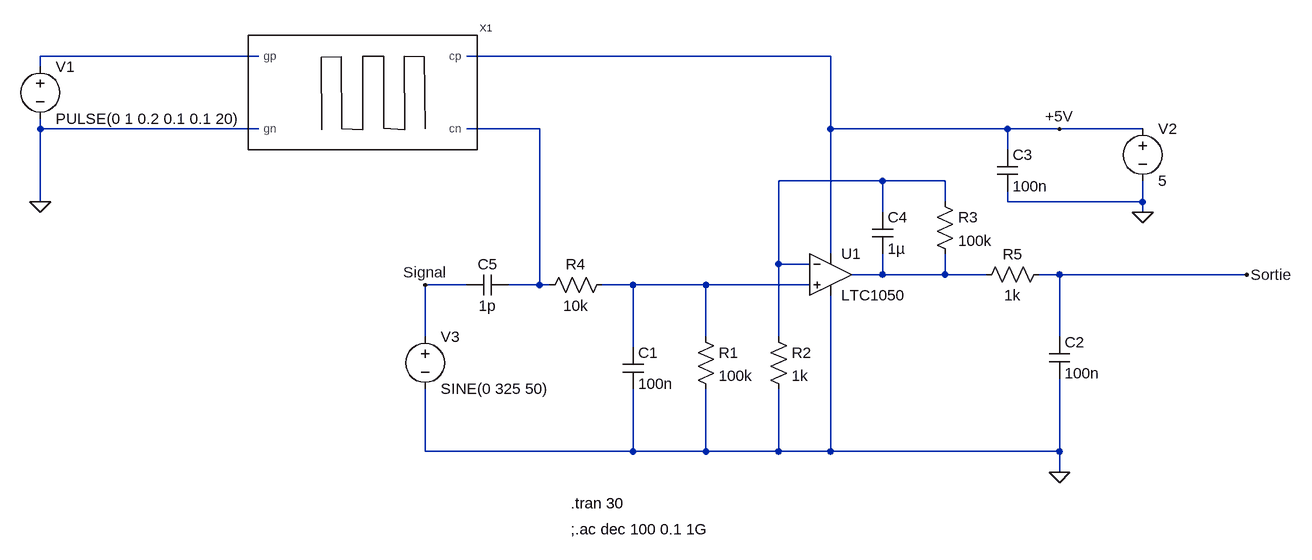
[diagram p0: schematic Draft1.asc]
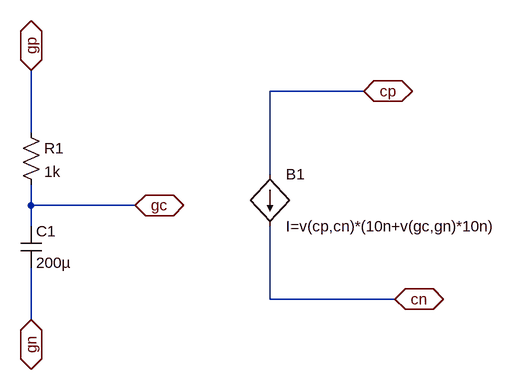
[diagram p1: sub-circuit capteur.asc]
Draft1.asc, the LTspice schematic file:
Version 4
SHEET 1 880 680
WIRE -992 -160 -1328 -160
WIRE -112 -160 -672 -160
WIRE -1328 -144 -1328 -160
WIRE -1328 -48 -1328 -64
WIRE -992 -48 -1328 -48
WIRE -560 -48 -672 -48
WIRE -112 -48 -112 -160
WIRE 160 -48 -112 -48
WIRE 240 -48 160 -48
WIRE 368 -48 240 -48
WIRE 160 -16 160 -48
WIRE -32 32 -192 32
WIRE 64 32 -32 32
WIRE -1328 64 -1328 -48
WIRE 64 64 64 32
WIRE 160 64 160 48
WIRE 368 64 368 32
WIRE 368 64 160 64
WIRE -32 80 -32 32
WIRE 368 80 368 64
WIRE -112 144 -112 -48
WIRE -192 160 -192 32
WIRE -144 160 -192 160
WIRE -32 176 -32 144
WIRE -32 176 -80 176
WIRE 64 176 64 144
WIRE 64 176 -32 176
WIRE 128 176 64 176
WIRE 240 176 208 176
WIRE 528 176 240 176
WIRE -672 192 -736 192
WIRE -560 192 -560 -48
WIRE -560 192 -608 192
WIRE -544 192 -560 192
WIRE -416 192 -464 192
WIRE -304 192 -416 192
WIRE -144 192 -304 192
WIRE -736 272 -736 192
WIRE -304 272 -304 192
WIRE -192 272 -192 160
WIRE 240 272 240 176
WIRE -416 288 -416 192
WIRE -736 448 -736 352
WIRE -416 448 -416 352
WIRE -416 448 -736 448
WIRE -304 448 -304 352
WIRE -304 448 -416 448
WIRE -192 448 -192 352
WIRE -192 448 -304 448
WIRE -112 448 -112 208
WIRE -112 448 -192 448
WIRE 240 448 240 336
WIRE 240 448 -112 448
WIRE 240 480 240 448
FLAG 240 480 0
FLAG 368 80 0
FLAG 240 -48 +5V
FLAG -736 192 Signal
FLAG 528 176 Sortie
FLAG -1328 64 0
SYMBOL res -320 256 R0
SYMATTR InstName R1
SYMATTR Value 100k
SYMBOL res -208 256 R0
SYMATTR InstName R2
SYMATTR Value 1k
SYMBOL res 48 48 R0
SYMATTR InstName R3
SYMATTR Value 100k
SYMBOL res -448 176 R90
WINDOW 0 0 56 VBottom 2
WINDOW 3 32 56 VTop 2
SYMATTR InstName R4
SYMATTR Value 10k
SYMBOL res 224 160 R90
WINDOW 0 0 56 VBottom 2
WINDOW 3 32 56 VTop 2
SYMATTR InstName R5
SYMATTR Value 1k
SYMBOL cap -432 288 R0
SYMATTR InstName C1
SYMATTR Value 100n
SYMBOL cap 224 272 R0
SYMATTR InstName C2
SYMATTR Value 100n
SYMBOL cap 144 -16 R0
SYMATTR InstName C3
SYMATTR Value 100n
SYMBOL cap -48 80 R0
SYMATTR InstName C4
SYMATTR Value 1µ
SYMBOL OpAmps\\LTC1050 -112 112 R0
SYMATTR InstName U1
SYMBOL voltage 368 -64 R0
WINDOW 123 0 0 Left 0
WINDOW 39 0 0 Left 0
SYMATTR InstName V2
SYMATTR Value 5
SYMBOL Capteur -1008 -192 R0
SYMATTR InstName X1
SYMBOL voltage -1328 -160 R0
WINDOW 123 0 0 Left 0
WINDOW 39 0 0 Left 0
SYMATTR InstName V1
SYMATTR Value PULSE(0 1 0.2 0.1 0.1 20)
SYMBOL cap -608 176 R90
WINDOW 0 0 32 VBottom 2
WINDOW 3 32 32 VTop 2
SYMATTR InstName C5
SYMATTR Value 1p
SYMBOL voltage -736 256 R0
WINDOW 123 0 0 Left 0
WINDOW 39 0 0 Left 0
SYMATTR InstName V3
SYMATTR Value SINE(0 325 50)
TEXT -512 528 Left 2 !.tran 30
TEXT -512 568 Left 2 !;.ac dec 100 0.1 1G

capteur.asc, the sub-circuit schematic file:
Version 4
SHEET 1 880 680
WIRE 560 16 416 16
WIRE 48 80 48 -16
WIRE 416 144 416 16
WIRE 48 192 48 160
WIRE 208 192 48 192
WIRE 48 224 48 192
WIRE 416 336 416 224
WIRE 608 336 416 336
WIRE 48 368 48 288
FLAG 208 192 gc
IOPIN 208 192 BiDir
FLAG 48 -16 gp
IOPIN 48 -16 BiDir
FLAG 48 368 gn
IOPIN 48 368 BiDir
FLAG 560 16 cp
IOPIN 560 16 BiDir
FLAG 608 336 cn
IOPIN 608 336 BiDir
SYMBOL res 32 64 R0
SYMATTR InstName R1
SYMATTR Value 1k
SYMBOL cap 32 224 R0
SYMATTR InstName C1
SYMATTR Value 200µ
SYMBOL bi 416 144 R0
SYMATTR InstName B1
SYMATTR Value I=v(cp,cn)*(10n+v(gc,gn)*10n)

The netlist it stands for:
* Draft1.asc
R1 N005 0 100k
R2 N003 0 1k
R3 N003 N004 100k
R4 N005 N002 10k
R5 Sortie N004 1k
C1 N005 0 100n
C2 Sortie 0 100n
C3 +5V 0 100n
C4 N003 N004 1µ
XU1 N005 N003 +5V 0 N004 LTC1050  ; pins In+ In- V+ V- OUT
V2 +5V 0 5
XX1 N001 0 +5V N002 capteur
V1 N001 0 PULSE(0 1 0.2 0.1 0.1 20)
C5 N002 Signal 1p
V3 Signal 0 SINE(0 325 50)

* block symbol definitions
.subckt capteur gp gn cp cn
R1 gp gc 1k
C1 gc gn 200µ
B1 cp cn I=v(cp,cn)*(10n+v(gc,gn)*10n)
.ends capteur

.tran 30
;.ac dec 100 0.1 1G
.lib LTC.lib
.backanno
.end